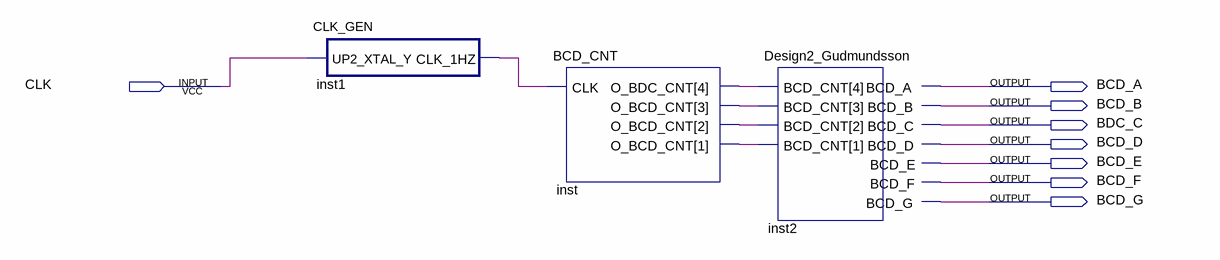
[diagram p0: schematic sheet]
// Quartus schematic Design3_Gudmundsson.bdf as structural Verilog: 3 symbols, 8 pins
module Design3_Gudmundsson (
  input  CLK,
  output BCD_A,
  output BCD_B,
  output BDC_C,
  output BCD_D,
  output BCD_E,
  output BCD_F,
  output BCD_G
);

  wire inst1_clk_1hz, inst_o_bcd_cnt, inst_o_bcd_cnt_2, inst_o_bcd_cnt_3, inst_o_bdc_cnt;

  CLK_GEN inst1 (.UP2_XTAL_Y(CLK), .CLK_1HZ(inst1_clk_1hz));
  BCD_CNT inst (
    .CLK(inst1_clk_1hz), .O_BDC_CNT(inst_o_bdc_cnt),
    .O_BCD_CNT({inst_o_bcd_cnt, inst_o_bcd_cnt_2, inst_o_bcd_cnt_3}));
  Design2_Gudmundsson inst2 (
    .BCD_CNT({inst_o_bdc_cnt, inst_o_bcd_cnt, inst_o_bcd_cnt_2, inst_o_bcd_cnt_3}), .BCD_A(BCD_A),
    .BCD_B(BCD_B), .BCD_C(BDC_C), .BCD_D(BCD_D), .BCD_E(BCD_E), .BCD_F(BCD_F), .BCD_G(BCD_G));
endmodule
